# Altium schematic sheet Sheet_1_2025-10-18 (1).schdoc
size 298 x 205 mm
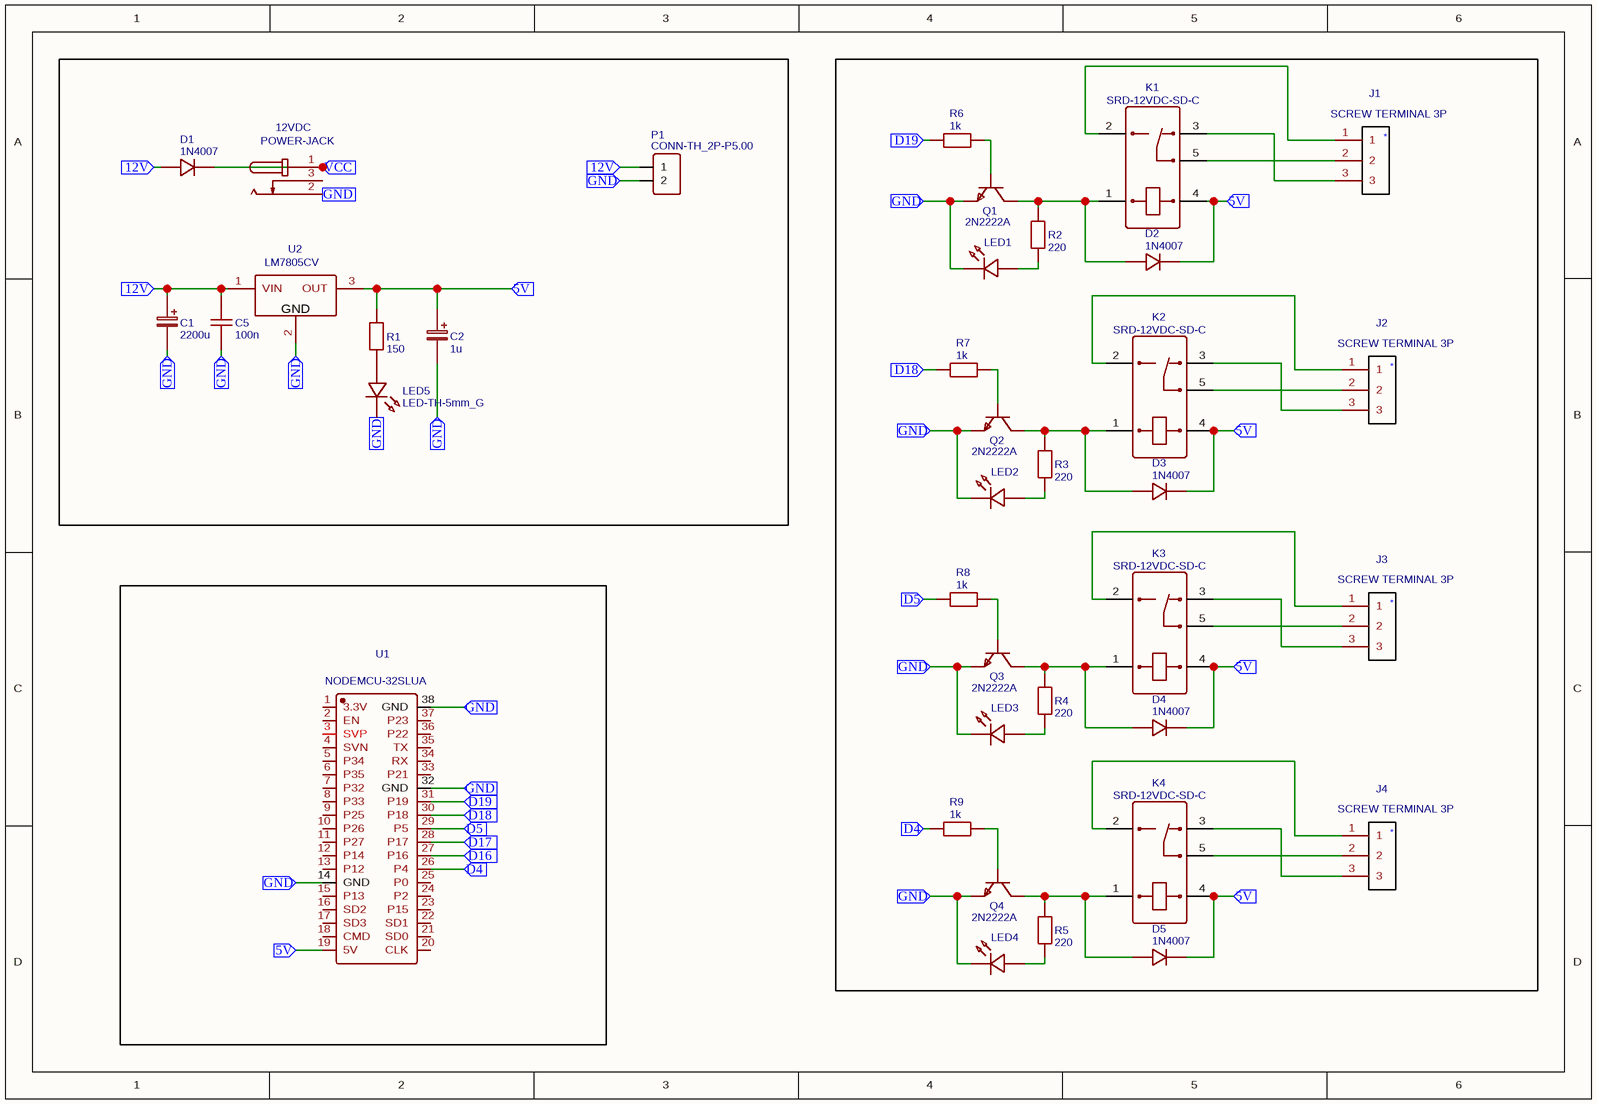
[diagram p0: Sheet_1_2025-10-18 (1).schdoc]

## Parts
12VDC  POWER-JACK  [JACK-POWER-SUPPLY]
C1  2200u  [CAP-D10.0×F5.0]
C2  1u  [CAP-D6.3×F2.5]
C5  100n  [RAD-0.1]
D1  1N4007  [DO-41_BD2.4-L4.7-P8.70-D0.9-RD]
D2  1N4007  [DO-41_BD2.4-L4.7-P8.70-D0.9-RD]
D3  1N4007  [DO-41_BD2.4-L4.7-P8.70-D0.9-RD]
D4  1N4007  [DO-41_BD2.4-L4.7-P8.70-D0.9-RD]
D5  1N4007  [DO-41_BD2.4-L4.7-P8.70-D0.9-RD]
J1  SCREW TERMINAL 3P  [SCREW_TERMINAL_5.08MM_3P]
J2  SCREW TERMINAL 3P  [SCREW_TERMINAL_5.08MM_3P]
J3  SCREW TERMINAL 3P  [SCREW_TERMINAL_5.08MM_3P]
J4  SCREW TERMINAL 3P  [SCREW_TERMINAL_5.08MM_3P]
K1  SRD-12VDC-SD-C  [RELAY-TH_SRD-XXVDC-SD-C]
K2  SRD-12VDC-SD-C  [RELAY-TH_SRD-XXVDC-SD-C]
K3  SRD-12VDC-SD-C  [RELAY-TH_SRD-XXVDC-SD-C]
K4  SRD-12VDC-SD-C  [RELAY-TH_SRD-XXVDC-SD-C]
LED1  LED-TH-5mm_R  [LED-TH_BD5.0_RED]  (value not drawn)
LED2  LED-TH-5mm_R  [LED-TH_BD5.0_RED]  (value not drawn)
LED3  LED-TH-5mm_R  [LED-TH_BD5.0_RED]  (value not drawn)
LED4  LED-TH-5mm_R  [LED-TH_BD5.0_RED]  (value not drawn)
LED5  LED-TH-5mm_G  [LED-TH_BD5.0_GREEN]
P1  CONN-TH_2P-P5.00  [CONN-TH_2P-P5.00]
Q1  2N2222A  [TO-92-3_L4.8-W3.7-P2.54-R]
Q2  2N2222A  [TO-92-3_L4.8-W3.7-P2.54-R]
Q3  2N2222A  [TO-92-3_L4.8-W3.7-P2.54-R]
Q4  2N2222A  [TO-92-3_L4.8-W3.7-P2.54-R]
R1  150  [R_AXIAL-0.3]
R2  220  [R_AXIAL-0.3]
R3  220  [R_AXIAL-0.3]
R4  220  [R_AXIAL-0.3]
R5  220  [R_AXIAL-0.3]
R6  1k  [R_AXIAL-0.3]
R7  1k  [R_AXIAL-0.3]
R8  1k  [R_AXIAL-0.3]
R9  1k  [R_AXIAL-0.3]
U1  NODEMCU-32SLUA  [COMM-TH_NODEMCU-32SLUA]
U2  LM7805CV  [LM7805CV]

## Ports
5V (in), 12V (in), D4 (in), D5 (in), D16 (in), D17 (in), D18 (in), D19 (in), GND (in), VCC (in)

## Nets
5V: C2.1 D2.1 D3.1 D4.1 D5.1 K1.4 K2.4 K3.4 K4.4 R1.2 U1.19(5V) U2.3(OUT) ; port 5V
12V: C1.1 C5.2 D1.2 P1.1 U2.1(VIN) ; port 12V
D4: R9.2 U1.26(P4) ; port D4
D5: R8.2 U1.29(P5) ; port D5
D16: U1.27(P16) ; port D16
D17: U1.28(P17) ; port D17
D18: R7.2 U1.30(P18) ; port D18
D19: R6.2 U1.31(P19) ; port D19
GND: 12VDC.2 C1.2 C2.2 C5.1 LED1.2 LED2.2 LED3.2 LED4.2 LED5.2 P1.2 Q1.3(E) Q2.3(E) Q3.3(E) Q4.3(E) U1.14(GND) U1.32(GND) U1.38(GND) U2.2(GND) ; port GND
VCC: 12VDC.1 D1.1 ; port VCC
NetD2_2: D2.2 K1.1 Q1.1(C) R2.2
NetD3_2: D3.2 K2.1 Q2.1(C) R3.2
NetD4_2: D4.2 K3.1 Q3.1(C) R4.2
NetD5_2: D5.2 K4.1 Q4.1(C) R5.2
NetJ1_1: J1.1 K1.2
NetJ1_2: J1.2 K1.5
NetJ1_3: J1.3 K1.3
NetJ2_1: J2.1 K2.2
NetJ2_2: J2.2 K2.5
NetJ2_3: J2.3 K2.3
NetJ3_1: J3.1 K3.2
NetJ3_2: J3.2 K3.5
NetJ3_3: J3.3 K3.3
NetJ4_1: J4.1 K4.2
NetJ4_2: J4.2 K4.5
NetJ4_3: J4.3 K4.3
NetLED1_1: LED1.1 R2.1
NetLED2_1: LED2.1 R3.1
NetLED3_1: LED3.1 R4.1
NetLED4_1: LED4.1 R5.1
NetLED5_1: LED5.1 R1.1
NetQ1_2: Q1.2(B) R6.1
NetQ2_2: Q2.2(B) R7.1
NetQ3_2: Q3.2(B) R8.1
NetQ4_2: Q4.2(B) R9.1

Not connected (* = marked no-connect by the designer): 12VDC 3; U1 1(3.3V) 2(EN) 3(SVP) 4(SVN) 5(P34) 6(P35) 7(P32) 8(P33) 9(P25) 10(P26) 11(P27) 12(P14) 13(P12) 15(P13) 16(SD2) 17(SD3) 18(CMD) 20(CLK) 21(SD0) 22(SD1) 23(P15) 24(P2) 25(P0) 33(P21) 34(RX) 35(TX) 36(P22) 37(P23)

## Library data of the parts
12VDC = POWER-JACK: Contributor: feli3925161; spicePre: C; spiceSymbolName: POWER-JACK
C1 = 2200u: nameAlias: Value(F); Contributor: LCEDA_Lib; spicePre: C; spiceSymbolName: CE_TH_D10.0×F5.0_EU
C2 = 1u: nameAlias: Value(F); Contributor: LCEDA_Lib; spicePre: C; spiceSymbolName: CE_TH_D6.3×F2.5_EU
C5 = 100n: nameAlias: Value(F); Contributor: LCEDA_Lib; spicePre: C; spiceSymbolName: C_RAD-0.1_US
D1-D5 = 1N4007: Manufacturer: SEMTECH; Contributor: LCEDA_Lib; Supplier: LCSC; Manufacturer Part: 1N4007; Supplier Part: C106903; spicePre: D; spiceSymbolName: 1N4007
J1-J4 = SCREW TERMINAL 3P: Manufacturer Part: 3 Pin Screw Terminal 5.08; Contributor: Richard Strofton; Supplier Part: 146-8259; Supplier: RS-Online; link: https://uk.rs-online.com/web/p/pcb-terminal-blocks/1468259; spicePre: J; spiceSymbolName: SCREW TERMINAL 3P
K1-K4 = SRD-12VDC-SD-C: Manufacturer: Ningbo Songle Relay; Contributor: LCSC; Supplier: LCSC; Supplier Part: C247843; Manufacturer Part: SRD-12VDC-SD-C; JLCPCB Part Class: Extended Part; spicePre: K; spiceSymbolName: SRD-12VDC-SD-C
LED1-LED4 = LED-TH-5mm_R: Manufacturer: EVERLIGHT(台湾亿光); Manufacturer Part: 333-2SURD/S530-A3; Contributor: LCEDA_Lib; Supplier Part: C87271; Supplier: LCSC; spicePre: L; spiceSymbolName: LED-TH-5mm_R
LED5 = LED-TH-5mm_G: Manufacturer: EVERLIGHT(台湾亿光); Manufacturer Part: 333-2SYGD/S530-E2; Contributor: LCEDA_Lib; Supplier Part: C88163; Supplier: LCSC; spicePre: L; spiceSymbolName: LED-TH-5mm_G
P1 = CONN-TH_2P-P5.00: Contributor: LCEDA_Lib; Supplier: LCSC; spicePre: P; spiceSymbolName: CONN-TH_2P-P5.00
Q1-Q4 = 2N2222A: Manufacturer: Foshan Blue Rocket Elec; Contributor: LCSC; Supplier: LCSC; Supplier Part: C358533; Manufacturer Part: 2N2222A; JLCPCB Part Class: Extended Part; spicePre: Q; spiceSymbolName: 2N2222A
R1 = 150: nameAlias: Value(Ω); Contributor: LCEDA_Lib; spicePre: R; spiceSymbolName: R_AXIAL-0.3_EU
R2-R5 = 220: nameAlias: Value(Ω); Contributor: LCEDA_Lib; spicePre: R; spiceSymbolName: R_AXIAL-0.3_EU
R6-R9 = 1k: nameAlias: Value(Ω); Contributor: LCEDA_Lib; spicePre: R; spiceSymbolName: R_AXIAL-0.3_EU
U1 = NODEMCU-32SLUA: Manufacturer: Ai-Thinker(安信可); Contributor: lcsc; Supplier: LCSC; Supplier Part: C111436; Manufacturer Part: NodeMCU-32SLua; link: https://atta.szlcsc.com/upload/public/pdf/source/20200715/C111436_7E615125D57381075B07FD61BFD5F595.pdf; JLCPCB Part Class: Extended Part; spicePre: U; spiceSymbolName: NODEMCU-32SLUA
U2 = LM7805CV: Manufacturer: HGC(Huaguan Semicon); Manufacturer Part: LM7805T; Contributor: LCSC; Supplier: LCSC; Supplier Part: C507145; JLCPCB Part Class: Extended Part; spicePre: U; spiceSymbolName: LM7805CV